# Altium schematic sheet beovox-poe.SchDoc (part 2 of 2)
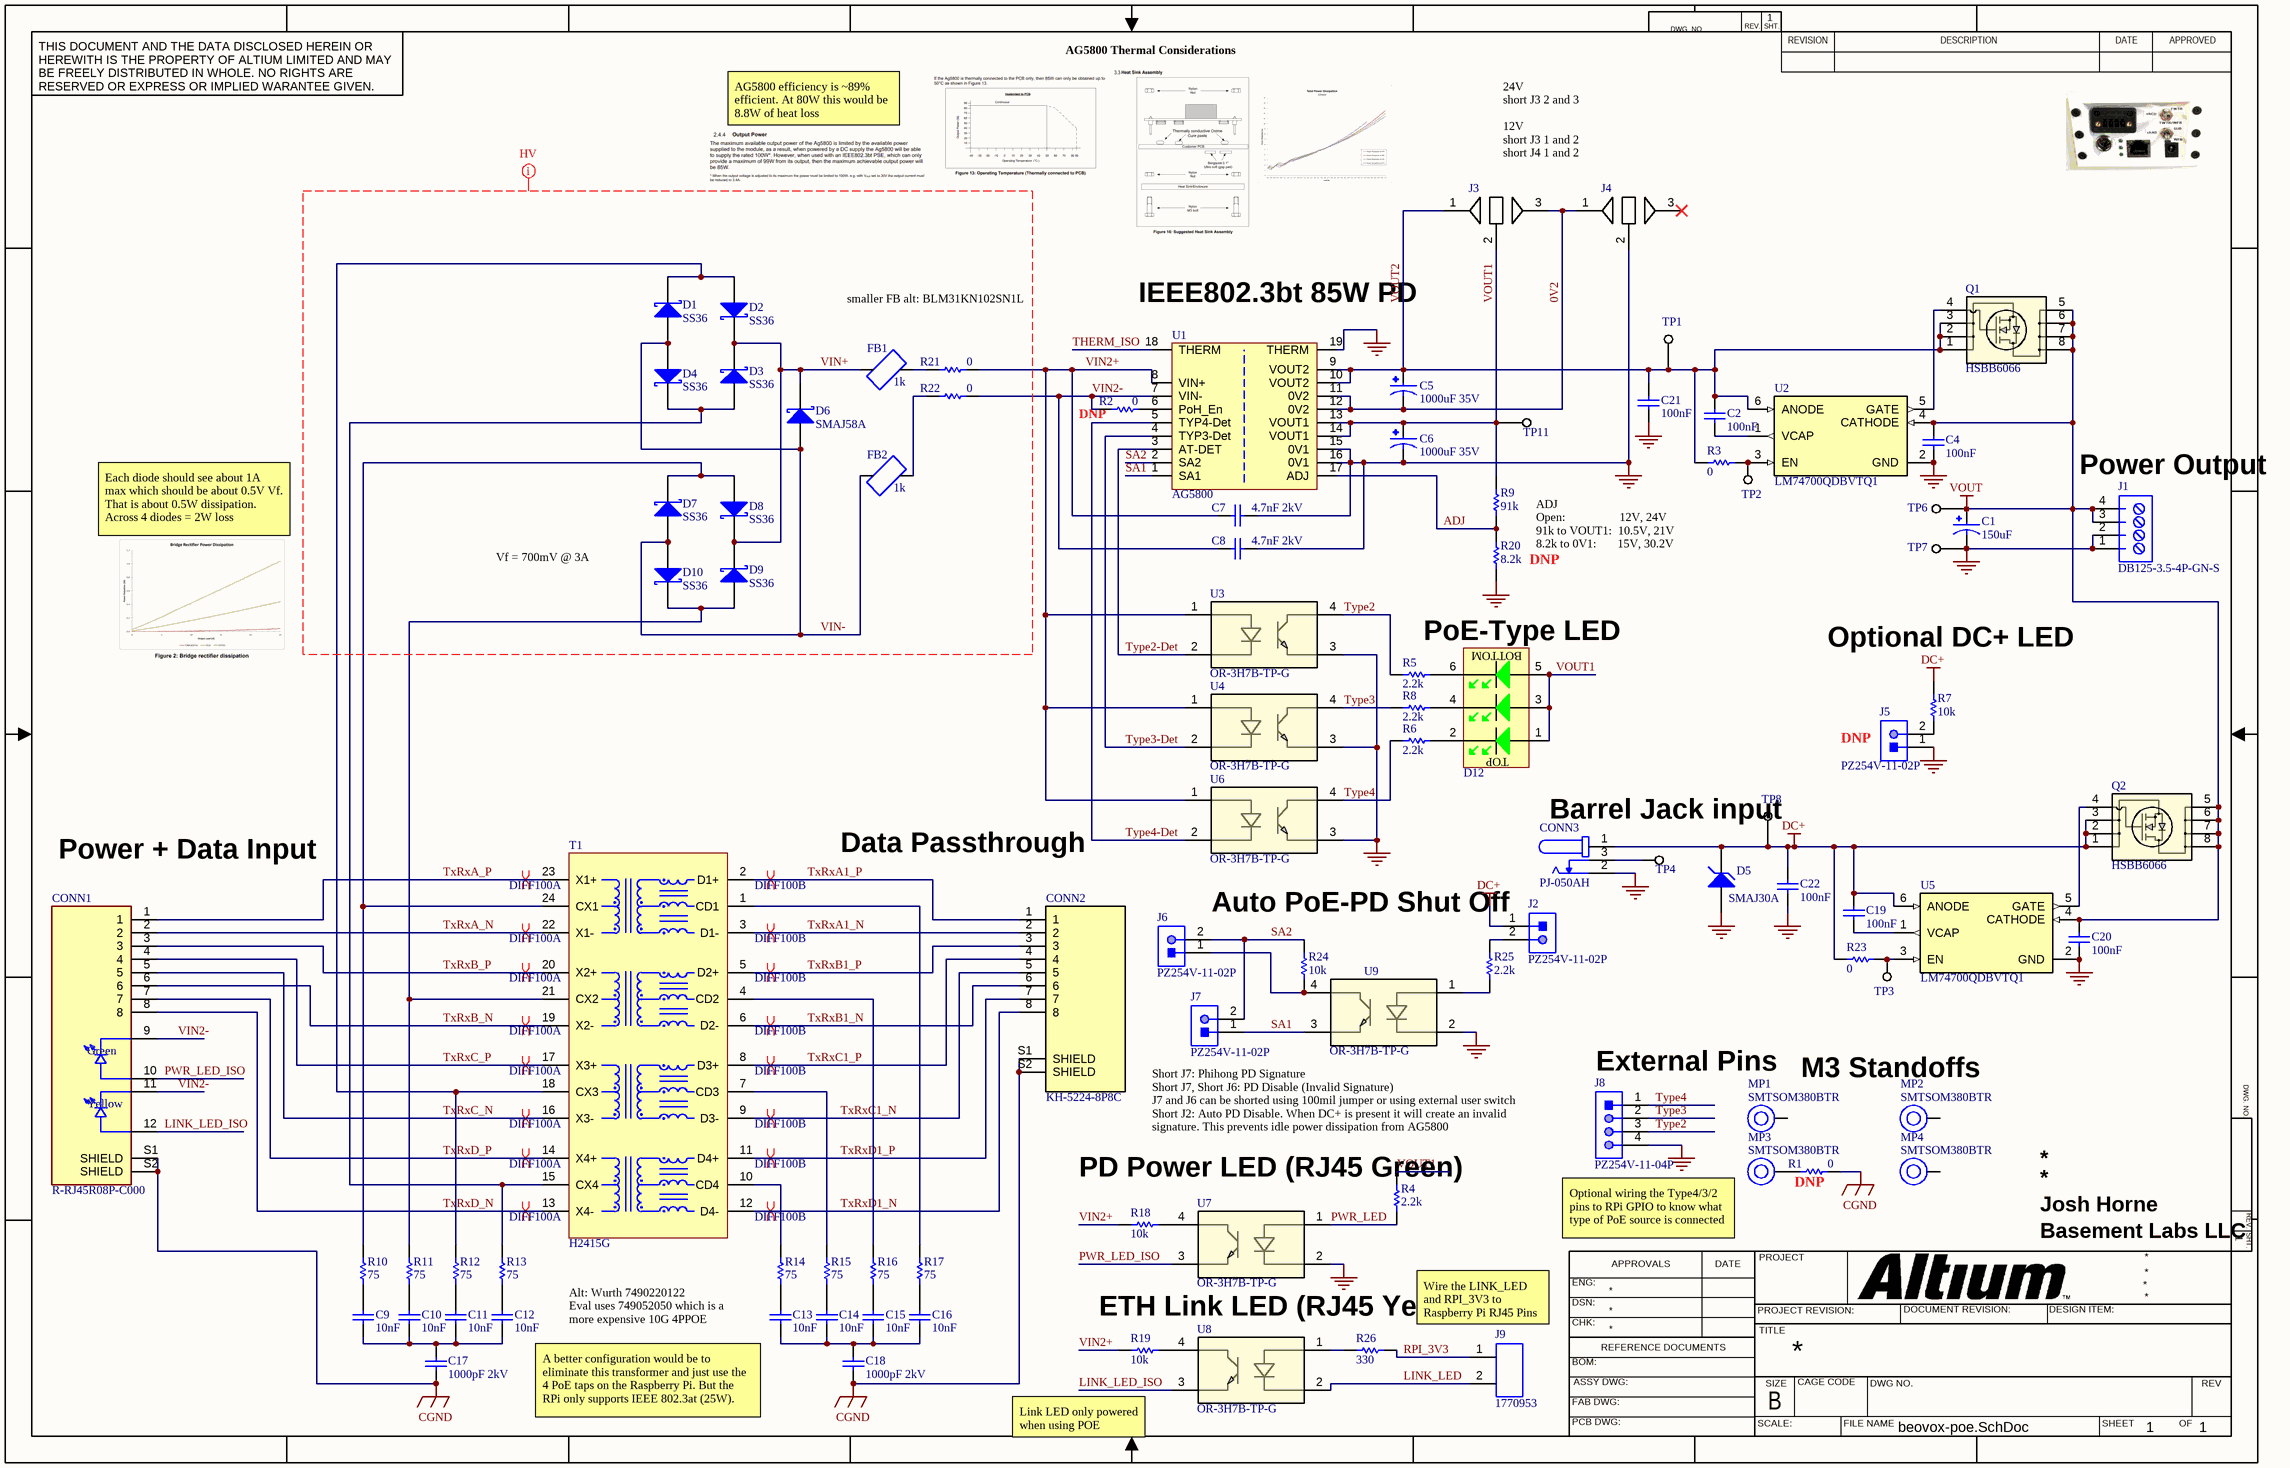
[diagram p1: beovox-poe.SchDoc]

## Library data of the parts
C1 = RC080M151LO10*16TH-2A1Et: 150uF 80V Aluminum Electrolytic Capacitors Through Hole,D10xL16mm 3000hrs@105℃; Manufacturer: BERYL Electronic Tech; ComponentLink1Description: LCSC; ComponentLink1URL: https://www.lcsc.com/product-detail/C7436420.html; Supplier: LCSC; Supplier Part Number: C7436420; Manufacturer Part Number: RC080M151LO10*16TH-2A1Et; Value: 150uF; Voltage: 80V
C2 C4 C19-C22 = C0603 100nF 50V X7R 10%: Multilayer Ceramic Capacitor, CC Series, 0.1 - F, - 10%, X7R, 50 V, 0603 [1608 Metric]; Manufacturer: Yageo; Manufacturer Part Number: CC0603KRX7R9BB104; Voltage Rating: 50V; Supplier 1: Future Electronics; RoHS: Yes; Category: Ceramic Capacitors; Stock 1: 10824000; Pricing 1: 4000=0.0056, 16000=0.0051, 20000=0.0053, 60000=0.0049, 80000=0.005, 160000=0.0048, 200000=0.0048, 400000=0.0046, 500000=0.0045 (USD); Mount: Surface Mount; Case/Package: 0603; Number of Pins: 2; Case Code (Metric): 1608; Case Code (Imperial): 0603; Dielectric Material: Ceramic; Material: Ceramic; Min Operating Temperature: -55°C; Max Operating Temperature: 125°C; Package Quantity: 1; Capacitance: 100nF; Tolerance: 10%; Packaging: Tape and Reel; Dielectric: X7R; Termination: SMD/SMT; Voltage: 50V; Series: CC; Length: 0.063inch; Width: 0.031inch; Height: 0.8mm; Thickness: 0.035inch; Depth: 0.8mm; Radiation Hardening: No; Reach SVHC Compliant: No; Lead Free: Lead Free; Halogen Free: Halogen Free; RoHS Compliant: Yes; ComponentLink1URL: https://datasheet.ciiva.com/11786/0900766b80d84f1d-11786061.pdf?src-supplier=Rs; ComponentLink1Description: https://datasheet.ciiva.com/11786/0900766b80d84f1d-11786061.pdf?src-supplier=Rs; ComponentLink2URL: https://datasheet.ciiva.com/31394/1489800-31394927.pdf?src-supplier=Farnell; ComponentLink2Description: https://datasheet.ciiva.com/31394/1489800-31394927.pdf?src-supplier=Farnell; ComponentLink3URL: https://datasheet.ciiva.com/144/mlccorderingcode-144176.pdf?src-supplier=Digikey; ComponentLink3Description: https://datasheet.ciiva.com/144/mlccorderingcode-144176.pdf?src-supplier=Digikey; ComponentLink4URL: https://datasheet.ciiva.com/144/mlccorderingcode-144177.pdf?src-supplier=Digikey; ComponentLink4Description: https://datasheet.ciiva.com/144/mlccorderingcode-144177.pdf?src-supplier=Digikey; ComponentLink5URL: https://datasheet.ciiva.com/144/mlccorderingcode-144178.pdf?src-supplier=Digikey; ComponentLink5Description: https://datasheet.ciiva.com/144/mlccorderingcode-144178.pdf?src-supplier=Digikey; ComponentLink6URL: https://datasheet.ciiva.com/7978/1489800-7978166.pdf?src-supplier=Element14; ComponentLink6Description: https://datasheet.ciiva.com/7978/1489800-7978166.pdf?src-supplier=Element14; ComponentLink7URL: https://datasheet.ciiva.com/8033/70765-8033819.pdf?src-supplier=Element14; ComponentLink7Description: https://datasheet.ciiva.com/8033/70765-8033819.pdf?src-supplier=Element14; ComponentLink8URL: https://datasheet.ciiva.com/8033/70765-8033821.pdf?src-supplier=Element14; ComponentLink8Description: https://datasheet.ciiva.com/8033/70765-8033821.pdf?src-supplier=Element14; ComponentLink9URL: https://datasheet.ciiva.com/22749/1489800-22749214.pdf?src-supplier=Element14; ComponentLink9Description: https://datasheet.ciiva.com/22749/1489800-22749214.pdf?src-supplier=Element14; Supplier Part Number 1: 3035896; ComponentLink10Description: LCSC; ComponentLink10URL: https://www.lcsc.com/product-detail/Multilayer-Ceramic-Capacitors-MLCC-SMD-SMT_YAGEO-CC0603KRX7R9BB104_C14663.html; Supplier: LCSC; Supplier Part Number: C14663
C5 C6 = ERR1VM102G20OT: 1000uF 35V ±20% Plugin,D10xL20mm Aluminum Electrolytic Capacitors - Leaded ROHS; Manufacturer: AISHI; Supplier: LCSC; Supplier Part Number: C398835; ComponentLink1Description: LCSC; ComponentLink1URL: https://www.lcsc.com/product-detail/Aluminum-Electrolytic-Capacitors-Leaded_AISHI-Aihua-Group-ERR1VM102G20OT_C398835.html; Manufacturer Part Number: ERR1VM102G20OT; Value: 1000uF; Voltage: 35V
C7 C8 = 1206B472K202NT: 2kV 4700pF X7R ±10% 1206 Multilayer Ceramic Capacitors MLCC - SMD/SMT ROHS; Manufacturer: FH (Guangdong Fenghua Advanced Tech); Supplier: LCSC; Supplier Part Number: C41017; Manufacturer Part Number: 1206B472K202NT; ComponentLink1Description: LCSC; ComponentLink1URL: https://www.lcsc.com/product-detail/Multilayer-Ceramic-Capacitors-MLCC-SMD-SMT_FH-Guangdong-Fenghua-Advanced-Tech-1206B472K202NT_C41017.html
C9-C16 = 0603B103K101CT: Multilayer Ceramic Capacitor, 0.01 F, 10%, X7R, 100 V, 0603 [1608 Metric] Rohs Compliant: Yes; Manufacturer: Walsin Technologies; Voltage Rating: 100V; Supplier 1: Arrow Electronics; Manufacturer Part Number: 0603B103K101CT; RoHS: Yes; Category: Ceramic Capacitors; Stock 1: 100000; Pricing 1: 4000=0.00810, 8000=0.00720, 12000=0.00620, 40000=0.00610 (USD); Case/Package: 0603; Case Code (Metric): 1608; Case Code (Imperial): 0603; Min Operating Temperature: -55°C; Max Operating Temperature: 125°C; Capacitance: 10nF; Tolerance: 10%; Packaging: Tape and Reel; Dielectric: X7R; Voltage Rating (DC): 100V; Length: 1.6mm; Depth: 0.8mm; RoHS Compliant: Yes; ComponentLink1URL: http://www.farnell.com/datasheets/2340522.pdf?src-supplier=Farnell; ComponentLink1Description: http://www.farnell.com/datasheets/2340522.pdf?src-supplier=Farnell; ComponentLink2URL: http://www.passivecomponent.com/wp-content/uploads/2018/10/MLCC.pdf?src-supplier=Digi-Key; ComponentLink2Description: http://www.passivecomponent.com/wp-content/uploads/2018/10/MLCC.pdf?src-supplier=Digi-Key; ComponentLink3URL: http://www.passivecomponent.com/indexsea/0603B103K101CT-IS.pdf?src-supplier=Digi-Key; ComponentLink3Description: http://www.passivecomponent.com/indexsea/0603B103K101CT-IS.pdf?src-supplier=Digi-Key; Supplier Part Number 1: 0603B103K101CT; ComponentLink4Description: http://www.farnell.com/datasheets/2340522.pdf?src-supplier=Element14; ComponentLink4URL: http://www.farnell.com/datasheets/2340522.pdf?src-supplier=Element14; Supplier: LCSC; Supplier Part Number: C302008; REACH SVHC: Unknown; ComponentLink5URL: http://www.farnell.com/datasheets/2340522.pdf?src-supplier=Newark; ComponentLink5Description: http://www.farnell.com/datasheets/2340522.pdf?src-supplier=Newark; ComponentLink6Description: LCSC; ComponentLink6URL: https://www.lcsc.com/product-detail/Multilayer-Ceramic-Capacitors-MLCC-SMD-SMT_Walsin-Tech-Corp-0603B103K101CT_C302008.html
C17 C18 = CC1206KKX7RDBB102: Multilayer Ceramic Capacitor, 1000 pF, 2000 V, ± 10%, X7R, 1206 [3216 Metric]; Manufacturer: Yageo; Material: 4241ConductorMaterial; Capacitance: 1nF; Dissipation Factor: 2.5%; Insulation Resistance: 10GR; Supplier 1: Future Electronics; Manufacturer Part Number: CC1206KKX7RDBB102; RoHS: Yes; Category: Ceramic Capacitors; Stock 1: 1107000; Pricing 1: 3000=0.0177, 9000=0.0171, 30000=0.0164, 60000=0.016, 120000=0.0154 (USD); Mount: Surface Mount; Case/Package: 1206; Number of Pins: 2; Case Code (Metric): 3216; Case Code (Imperial): 1206; Min Operating Temperature: -55°C; Max Operating Temperature: 125°C; Tolerance: 10%; Dielectric: X7R; Packaging: Tape and Reel; Termination: SMD/SMT; Voltage: 2kV; Package Quantity: 1; Voltage Rating: 2kV; Voltage Rating (DC): 2kV; Series: CC; Construction: Flat; Length: 3.2mm; Width: 0.063inch; Height: 1.25mm; Depth: 1.6mm; Thickness: 0.057inch; Radiation Hardening: No; RoHS Compliant: Yes; Lead Free: Lead Free; Reach SVHC Compliant: Unknown; ComponentLink1URL: https://datasheet.ciiva.com/23942/1449957-23942422.pdf?src-supplier=Newark; ComponentLink1Description: https://datasheet.ciiva.com/23942/1449957-23942422.pdf?src-supplier=Newark; ComponentLink2URL: https://datasheet.ciiva.com/186/upy-np0x7r-hv-1kv-to-3kv-4-186736.pdf?src-supplier=Digi-Key; ComponentLink2Description: https://datasheet.ciiva.com/186/upy-np0x7r-hv-1kv-to-3kv-4-186736.pdf?src-supplier=Digi-Key; ComponentLink3URL: https://datasheet.ciiva.com/186/upy-np0x7r-hv-1kv-to-3kv-4-186735.pdf?src-supplier=Digi-Key; ComponentLink3Description: https://datasheet.ciiva.com/186/upy-np0x7r-hv-1kv-to-3kv-4-186735.pdf?src-supplier=Digi-Key; ComponentLink4URL: https://datasheet.ciiva.com/186/upy-np0x7r-hv-1kv-to-3kv-4-186737.pdf?src-supplier=Digi-Key; ComponentLink4Description: https://datasheet.ciiva.com/186/upy-np0x7r-hv-1kv-to-3kv-4-186737.pdf?src-supplier=Digi-Key; ComponentLink5URL: https://datasheet.ciiva.com/13386/upy-gp-np0-16v-to-50v-8-13386312.pdf?src-supplier=Mouser; ComponentLink5Description: https://datasheet.ciiva.com/13386/upy-gp-np0-16v-to-50v-8-13386312.pdf?src-supplier=Mouser; Supplier Part Number 1: 2008092; Supplier: LCSC; Supplier Part Number: C23631; Value: 1000pF 2kV; ComponentLink6Description: LCSC; ComponentLink6URL: https://www.lcsc.com/product-detail/Multilayer-Ceramic-Capacitors-MLCC-SMD-SMT_YAGEO-CC1206KKX7RDBB102_C23631.html
CONN1 = R-RJ45R08P-C000: RJ45 RJReceptacle 1 有屏蔽 Right-Angle WithLED 0℃~+70℃ Plugin Ethernet Connectors/Modular Connectors (RJ45 RJ11) ROHS; Manufacturer: Ckmtw; Supplier: LCSC; Supplier Part Number: C386757; Manufacturer Part Number: R-RJ45R08P-C000; ComponentLink1Description: LCSC; ComponentLink1URL: https://www.lcsc.com/product-detail/Ethernet-Connectors-Modular-Connectors-RJ45-RJ11_Ckmtw-Shenzhen-Cankemeng-R-RJ45R08P-C000_C386757.html
CONN2 = KH-5224-8P8C: Jack Modular Connector RJ45 Through Hole Shielded; Manufacturer: Kinghelm; Supplier: LCSC; Supplier Part Number: C2683357; Manufacturer Part Number: KH-5224-8P8C; ComponentLink1Description: LCSC; ComponentLink1URL: https://www.lcsc.com/product-detail/C2683357.html?spm=wm.fly.bg.28.xh&lcsc_vid=QlNcX1QCFlleAgYFTwAPUwdVRFJdA1ICT1MNBVIAEVgxVlNRQVFbUFdRT1VfXzsOAxUeFF5JWBYZEEoKFBINSQcJGk4%3D
CONN3 = PJ-050AH: 2.0 x 6.0 mm, 5.0 A, Horizontal, Through Hole, Pick-n-Place Top, Dc Power Jack Connector; Manufacturer: Same Sky; Current Rating: 5A; Inside Diameter: 2mm; Number of Conductors: 2; Outside Diameter: 6mm; Shielding: Unshielded; Voltage Rating: 24V; Supplier 1: DigiKey; Manufacturer Part Number: PJ-050AH; RoHS: Compliant; Category: Power Connectors; Stock 1: 43845; Pricing 1: 1=1.16, 10=0.988, 25=0.9256, 50=0.8814, 100=0.8393, 250=0.78672, 500=0.74916, 1000=0.71339, 2500=0.66873 (USD); Contact Plating: Silver; Export Control Classification Number (ECCN) Code: EAR99; Harmonized Tariff Schedule (HTS) Code: 8536.69.40.20; Introduction Date: 2018-06-13; Lifecycle Status: Production; Max Operating Temperature: 85°C; Min Operating Temperature: -25°C; Mount: Through Hole; Number of Pins: 2; Orientation: Horizontal; REACH SVHC: Yes; Schedule B: 8536695050, 8536695050|8536695050, 8536695050|8536695050|8536695050, 8536695050|8536695050|8536695050|8536695050; Voltage Rating (DC): 24V; ComponentLink1URL: https://datasheet.octopart.com:443/PJ-050AH-Same-Sky-datasheet-188849567.pdf?src-supplier=Same+Sky; ComponentLink1Description: https://datasheet.octopart.com:443/PJ-050AH-Same-Sky-datasheet-188849567.pdf?src-supplier=Same+Sky; ComponentLink2URL: https://datasheet.octopart.com:443/PJ-050AH-Same-Sky-datasheet-181917340.pdf?src-supplier=Same+Sky; ComponentLink2Description: https://datasheet.octopart.com:443/PJ-050AH-Same-Sky-datasheet-181917340.pdf?src-supplier=Same+Sky; ComponentLink3URL: https://datasheet.octopart.com:443/PJ-050AH-Same-Sky-datasheet-181917339.pdf?src-supplier=Same+Sky; ComponentLink3Description: https://datasheet.octopart.com:443/PJ-050AH-Same-Sky-datasheet-181917339.pdf?src-supplier=Same+Sky; ComponentLink4URL: https://datasheet.octopart.com:443/PJ-050AH-CUI-Devices-datasheet-175924817.pdf?src-supplier=Same+Sky; ComponentLink4Description: https://datasheet.octopart.com:443/PJ-050AH-CUI-Devices-datasheet-175924817.pdf?src-supplier=Same+Sky; ComponentLink5URL: https://datasheet.octopart.com:443/PJ-050AH-CUI-Devices-datasheet-137941395.pdf?src-supplier=Same+Sky; ComponentLink5Description: https://datasheet.octopart.com:443/PJ-050AH-CUI-Devices-datasheet-137941395.pdf?src-supplier=Same+Sky; ComponentLink6URL: https://datasheet.octopart.com:443/PJ-050AH-CUI-Devices-datasheet-180437501.pdf?src-supplier=IHS; ComponentLink6Description: https://datasheet.octopart.com:443/PJ-050AH-CUI-Devices-datasheet-180437501.pdf?src-supplier=IHS; ComponentLink7URL: https://datasheet.octopart.com:443/PJ-050AH-Same-Sky-datasheet-190141980.pdf?src-supplier=element14+APAC; ComponentLink7Description: https://datasheet.octopart.com:443/PJ-050AH-Same-Sky-datasheet-190141980.pdf?src-supplier=element14+APAC; ComponentLink8URL: https://datasheet.octopart.com:443/PJ-050AH-Same-Sky-datasheet-182880940.pdf?src-supplier=Electro+Sonic; ComponentLink8Description: https://datasheet.octopart.com:443/PJ-050AH-Same-Sky-datasheet-182880940.pdf?src-supplier=Electro+Sonic; ComponentLink9URL: https://datasheet.octopart.com:443/PJ-050AH-CUI-Devices-datasheet-175925602.pdf?src-supplier=Master+Electronics; ComponentLink9Description: https://datasheet.octopart.com:443/PJ-050AH-CUI-Devices-datasheet-175925602.pdf?src-supplier=Master+Electronics; ComponentLink10URL: https://datasheet.octopart.com:443/PJ-050AH-CUI-Devices-datasheet-141000282.pdf?src-supplier=Master+Electronics; ComponentLink10Description: https://datasheet.octopart.com:443/PJ-050AH-CUI-Devices-datasheet-141000282.pdf?src-supplier=Master+Electronics; ComponentLink11URL: https://datasheet.octopart.com:443/PJ-050AH-CUI-Devices-datasheet-103111417.pdf?src-supplier=Master+Electronics; ComponentLink11Description: https://datasheet.octopart.com:443/PJ-050AH-CUI-Devices-datasheet-103111417.pdf?src-supplier=Master+Electronics; ComponentLink12URL: https://datasheet.octopart.com:443/PJ-050AH-Same-Sky-datasheet-189105235.pdf?src-supplier=Master+Electronics; ComponentLink12Description: https://datasheet.octopart.com:443/PJ-050AH-Same-Sky-datasheet-189105235.pdf?src-supplier=Master+Electronics; ComponentLink13URL: https://datasheet.octopart.com:443/PJ-050AH-Same-Sky-datasheet-182049891.pdf?src-supplier=Future+Electronics; ComponentLink13Description: https://datasheet.octopart.com:443/PJ-050AH-Same-Sky-datasheet-182049891.pdf?src-supplier=Future+Electronics; ComponentLink14URL: https://datasheet.octopart.com:443/PJ-050AH-CUI-Devices-datasheet-175923567.pdf?src-supplier=Future+Electronics; ComponentLink14Description: https://datasheet.octopart.com:443/PJ-050AH-CUI-Devices-datasheet-175923567.pdf?src-supplier=Future+Electronics; ComponentLink15URL: https://datasheet.octopart.com:443/PJ-050AH-CUI-Devices-datasheet-137760689.pdf?src-supplier=Future+Electronics; ComponentLink15Description: https://datasheet.octopart.com:443/PJ-050AH-CUI-Devices-datasheet-137760689.pdf?src-supplier=Future+Electronics; ComponentLink16URL: https://datasheet.octopart.com:443/PJ-050AH-CUI-Devices-datasheet-175927643.pdf?src-supplier=CUI+Devices+SCT; ComponentLink16Description: https://datasheet.octopart.com:443/PJ-050AH-CUI-Devices-datasheet-175927643.pdf?src-supplier=CUI+Devices+SCT; ComponentLink17URL: https://datasheet.octopart.com:443/PJ-050AH-CUI-Devices-datasheet-142370881.pdf?src-supplier=CUI+Devices+SCT; ComponentLink17Description: https://datasheet.octopart.com:443/PJ-050AH-CUI-Devices-datasheet-142370881.pdf?src-supplier=CUI+Devices+SCT; ComponentLink18URL: https://octopart.com:443/opatz8j6/c1?t=i1HNAP8sau4DI-LZx3jDgI0-SWlYt3fLx_IRO_2-_sGd8kJlzHOsJDbcJeITI66mPXy8W__Xgt3piNIobSJpvViutKRXA4bS4Nrz0A8VAN4c8JG51UBHIn2tin4HAiUxuxhA7LdmnYlJsfGQu4wYFxkunNJbmBP4RDTvO_9ujz0txzSwc7TQjMJP2liQb9TTCHcH4_0bcC0I0RPZ1OY3ZJDDsG_xX9EgIXLeakTO5TNd2iYSdlOWFMgXhUfzV2AZOxi4wCzVrZ3pS8qpnh6vhskC-yXDoQGycuq9NoVRigowJ_F47T6Jf_exHFrpKD5_tLQCHcwME9nRgdOqiRs_2Sf2sHpBOw&src-supplier=Compliance+Statements; ComponentLink18Description: https://octopart.com:443/opatz8j6/c1?t=i1HNAP8sau4DI-LZx3jDgI0-SWlYt3fLx_IRO_2-_sGd8kJlzHOsJDbcJeITI66mPXy8W__Xgt3piNIobSJpvViutKRXA4bS4Nrz0A8VAN4c8JG51UBHIn2tin4HAiUxuxhA7LdmnYlJsfGQu4wYFxkunNJbmBP4RDTvO_9ujz0txzSwc7TQjMJP2liQb9TTCHcH4_0bcC0I0RPZ1OY3ZJDDsG_xX9EgIXLeakTO5TNd2iYSdlOWFMgXhUfzV2AZOxi4wCzVrZ3pS8qpnh6vhskC-yXDoQGycuq9NoVRigowJ_F47T6Jf_exHFrpKD5_tLQCHcwME9nRgdOqiRs_2Sf2sHpBOw&src-supplier=Compliance+Statements; ComponentLink19URL: https://octopart.com:443/opatz8j6/c1?t=wghVw_L1We_XWVlVY8JyDPw6lxvMinRws7-ARU-VAWs-ryFcBuT4vQKX4NLeCdwIA5aNEyug047cBfxCvivV2siU9ei9l80cJNjSbW06i8UrCY_EzWCp-dyawC3hrJNXrvZBXw-IQXK5amSqRYS1pt4_DqC-jT23v6yNOp-UfvUw-7gTEcBL8SujWfUUfSgsI8u124iBLyBSRX1OLjM7MRIPYR4R97L9CtcepMoCH6l_FDhW7at-B344Ry8AMoz31TQfvrWYgCManlUz1zqOBKOHlrNi2ifiEYHdtYXUYuwDLdPu8m0ipxZrudx8zgq-sTX51For5OOvefaN7lFtuiKG6VH6xbMjNYw&src-supplier=Compliance+Statements; ComponentLink19Description: https://octopart.com:443/opatz8j6/c1?t=wghVw_L1We_XWVlVY8JyDPw6lxvMinRws7-ARU-VAWs-ryFcBuT4vQKX4NLeCdwIA5aNEyug047cBfxCvivV2siU9ei9l80cJNjSbW06i8UrCY_EzWCp-dyawC3hrJNXrvZBXw-IQXK5amSqRYS1pt4_DqC-jT23v6yNOp-UfvUw-7gTEcBL8SujWfUUfSgsI8u124iBLyBSRX1OLjM7MRIPYR4R97L9CtcepMoCH6l_FDhW7at-B344Ry8AMoz31TQfvrWYgCManlUz1zqOBKOHlrNi2ifiEYHdtYXUYuwDLdPu8m0ipxZrudx8zgq-sTX51For5OOvefaN7lFtuiKG6VH6xbMjNYw&src-supplier=Compliance+Statements; ComponentLink20URL: https://octopart.com:443/opatz8j6/c1?t=2_WbWo_pjT-AGMZJ9OQyYCnH7mubsPdZALBDoVNei6KrV_IJjYFhq8H0kH6bJt5HXLU_kSM462KjxS6S93sfBWBhXllcdMUOW5uUkFoO8Z-X-V9fHvlvoFqHTLFpSA2_nIMsODPkX3eq3Z_QcS6RZ0G0moIALLZaz5osZaUUtGDom_OSRSJJ983Ee6OC2wkAKsSF_mfcXI5Hw5uKrkMhLylyvUVHrLyCkIp7sDv8gEkhEgjpLCTJ6fzmZzlstrZUr7VR9KoJzewnrvBxvFLR-UjI8AZw4Tnb4SG4kqVxv10bMQ-fg732zY5MnvzV3ohKdJvlg_bIkjJxFpuQir69v0P-Xf72NA&src-supplier=Compliance+Statements; ComponentLink20Description: https://octopart.com:443/opatz8j6/c1?t=2_WbWo_pjT-AGMZJ9OQyYCnH7mubsPdZALBDoVNei6KrV_IJjYFhq8H0kH6bJt5HXLU_kSM462KjxS6S93sfBWBhXllcdMUOW5uUkFoO8Z-X-V9fHvlvoFqHTLFpSA2_nIMsODPkX3eq3Z_QcS6RZ0G0moIALLZaz5osZaUUtGDom_OSRSJJ983Ee6OC2wkAKsSF_mfcXI5Hw5uKrkMhLylyvUVHrLyCkIp7sDv8gEkhEgjpLCTJ6fzmZzlstrZUr7VR9KoJzewnrvBxvFLR-UjI8AZw4Tnb4SG4kqVxv10bMQ-fg732zY5MnvzV3ohKdJvlg_bIkjJxFpuQir69v0P-Xf72NA&src-supplier=Compliance+Statements; ComponentLink21URL: https://octopart.com:443/opatz8j6/c1?t=8DYyr6UACYp_9EHoBQOMUJpe-oai5MtZyHfGsF7pMfqiyjsSsAlZxyG1X-4M3zPZXZjKmQkWcUbU005QJnBJ0VVRjtjOP6E0jnpPkUsKcjC4aqrxFP9fuOKb9IumRhvlA-YeXV-s67AJ9Ft3kafBMu_ZrryxXHEyusfRGv_sESHb_v2cGG7yXqcLMHQYIXRg53oH9-p2USlc4h_2uVf8lrwAuzWLZ-jnEAs8ZLSn6kwl23auHyfukigGyZzktJhlMS-c6-ffI1F_xetVy8m-uNDLnjE63CcaC0sp0xpLMmAGVVIs7dvYX1LTvWTLU-CH_THFZcN-5NbFwrXCu7zChi3WwqkNelJ-7s0&src-supplier=Compliance+Statements; ComponentLink21Description: https://octopart.com:443/opatz8j6/c1?t=8DYyr6UACYp_9EHoBQOMUJpe-oai5MtZyHfGsF7pMfqiyjsSsAlZxyG1X-4M3zPZXZjKmQkWcUbU005QJnBJ0VVRjtjOP6E0jnpPkUsKcjC4aqrxFP9fuOKb9IumRhvlA-YeXV-s67AJ9Ft3kafBMu_ZrryxXHEyusfRGv_sESHb_v2cGG7yXqcLMHQYIXRg53oH9-p2USlc4h_2uVf8lrwAuzWLZ-jnEAs8ZLSn6kwl23auHyfukigGyZzktJhlMS-c6-ffI1F_xetVy8m-uNDLnjE63CcaC0sp0xpLMmAGVVIs7dvYX1LTvWTLU-CH_THFZcN-5NbFwrXCu7zChi3WwqkNelJ-7s0&src-supplier=Compliance+Statements; Supplier Part Number 1: CP-050AH-ND; ComponentLink22Description: DigiKey; ComponentLink22URL: https://www.digikey.com/en/products/detail/same-sky-formerly-cui-devices/PJ-050AH/1644583; ComponentLink23Description: LCSC; ComponentLink23URL: https://www.lcsc.com/product-detail/C3096089.html?s_z=n_PJ-050AH; Supplier: LCSC; Supplier Part Number: C3096089
D1-D4 D7-D10 = SS36: 60V 700mV@3A 3A SMA(DO-214AC) Schottky Barrier Diodes (SBD) ROHS; Manufacturer: MDD; Value: 60V 3A; Supplier: LCSC; Supplier Part Number: C16015; Manufacturer Part Number: SS36; ComponentLink1Description: LCSC; ComponentLink1URL: https://www.lcsc.com/product-detail/Schottky-Barrier-Diodes-SBD_MDD-Microdiode-Electronics-SS36_C16015.html
D5 = SMAJ30A: Diode TVS Single Uni-Dir 30V 400W 2-Pin SMA; Manufacturer: Littelfuse; Direction: Unidirectional; Max Surge Current: 8.3A; Number of Elements: 1; Reverse Breakdown Voltage: 33.3V; Clamping Voltage: 48.4V; Power Line Protection: No; Max Breakdown Voltage: 36.8V; Max Reverse Leakage Current: 1uA; Test Current: 1mA; Max Power Dissipation: 3.3W; Supplier 1: RSComponents; Manufacturer Part Number: SMAJ30A; RoHS: Yes; Category: TVS Diodes; Stock 1: 200; Pricing 1: 25=0.34200, 50=0.28200, 100=0.27200, 200=0.26800, 400=0.26200 (USD); Mount: Surface Mount; Case/Package: SMA; Number of Pins: 2; Min Operating Temperature: -65°C; Max Operating Temperature: 150°C; Package Quantity: 5000; Packaging: Tape and Reel; Operating Supply Voltage: 30V; Number of Unidirectional Channels: 1; Reverse Standoff Voltage: 30V; Min Breakdown Voltage: 33.3V; Peak Pulse Power: 400W; Breakdown Voltage: 33.3V; Number of Channels: 1; Polarity: Unidirectional; Termination: SMD/SMT; Power Dissipation: 400W; Peak Pulse Current: 8.3A; Element Configuration: Single; Leakage Current: 1uA; Voltage Rating (DC): 30V; Resistor Type: Zener; Length: 4.5mm; Width: 2.79mm; Height: 2.087mm; Radiation Hardening: No; REACH SVHC: No SVHC; Lead Free: Lead Free; RoHS Compliant: Yes; ComponentLink1URL: https://datasheet.ciiva.com/25624/0900766b810f4edb-25624874.pdf?src-supplier=RSComponents; ComponentLink1Description: https://datasheet.ciiva.com/25624/0900766b810f4edb-25624874.pdf?src-supplier=RSComponents; ComponentLink2URL: https://datasheet.ciiva.com/22638/607617-22638012.pdf?src-supplier=Element14; ComponentLink2Description: https://datasheet.ciiva.com/22638/607617-22638012.pdf?src-supplier=Element14; ComponentLink3URL: https://datasheet.ciiva.com/14162/smaj-eng-ds-14162071.pdf?src-supplier=Distrelec; ComponentLink3Description: https://datasheet.ciiva.com/14162/smaj-eng-ds-14162071.pdf?src-supplier=Distrelec; ComponentLink4URL: https://datasheet.ciiva.com/5771/littelfuse-tvs-diode-smaj-5771023.pdf?src-supplier=Farnell; ComponentLink4Description: https://datasheet.ciiva.com/5771/littelfuse-tvs-diode-smaj-5771023.pdf?src-supplier=Farnell; ComponentLink5URL: https://datasheet.ciiva.com/8062/littelfuse-tvs-diode-smaj-8062298.pdf?src-supplier=Element14; ComponentLink5Description: https://datasheet.ciiva.com/8062/littelfuse-tvs-diode-smaj-8062298.pdf?src-supplier=Element14; ComponentLink6URL: https://datasheet.ciiva.com/330/littelfuse-tvs-diode-smaj-datasheet-pdf-330695.pdf?src-supplier=Digi-Key; ComponentLink6Description: https://datasheet.ciiva.com/330/littelfuse-tvs-diode-smaj-datasheet-pdf-330695.pdf?src-supplier=Digi-Key; ComponentLink7URL: https://datasheet.ciiva.com/330/littelfuse-tvs-diode-smaj-datasheet-pdf-330696.pdf?src-supplier=Digi-Key; ComponentLink7Description: https://datasheet.ciiva.com/330/littelfuse-tvs-diode-smaj-datasheet-pdf-330696.pdf?src-supplier=Digi-Key; ComponentLink8URL: https://datasheet.ciiva.com/330/littelfuse-tvs-diode-smaj-datasheet-pdf-330694.pdf?src-supplier=Digi-Key; ComponentLink8Description: https://datasheet.ciiva.com/330/littelfuse-tvs-diode-smaj-datasheet-pdf-330694.pdf?src-supplier=Digi-Key; ComponentLink9Description: LCSC; ComponentLink9URL: https://www.lcsc.com/product-detail/C148230.html?s_z=n_SMAJ30A; Supplier: LCSC; Supplier Part Number: C148230
D6 = SMAJ58A: 4.3A 400W 93.6V 64.4V 58V SMA(DO-214AC) TVS ROHS; Manufacturer: GOODWORK; Value: 58V 400W; Manufacturer Part Number: SMAJ58A; Supplier: LCSC; Supplier Part Number: C2980408; ComponentLink1Description: LCSC; ComponentLink1URL: https://www.lcsc.com/product-detail/TVS_GOODWORK-SMAJ58A_C2980408.html
D12 = MHK33147CGBTD: 20mA 30mcd 雾状绿透镜 -40℃~+85℃ 568nm Green 60° 2.6V DIP-6-2.54mm Light Emitting Diodes (LED) ROHS; Manufacturer: MEIHUA; ComponentLink1Description: LCSC; ComponentLink1URL: https://www.lcsc.com/product-detail/Light-Emitting-Diodes-LED_MEIHUA-MHK33147CGBTD_C7470849.html; Manufacturer Part Number: MHK33147CGBTD; Supplier: LCSC; Supplier Part Number: C7470849
FB1 FB2 = FBMH4525HM102NTV: Ind Chip Bead Multi-Layer 1KOhm 30% 100MHz Ferrite 3A 1810 T/R; Manufacturer: TAIYO YUDEN; DC Resistance (DCR): 60mΩ; Impedance: 1kΩ; Number of Circuits: 1; Supplier 1: DigiKey; Manufacturer Part Number: FBMH4525HM102NTV; RoHS: Compliant; Category: Ferrite Beads and Chips; Stock 1: 1225; Pricing 1: 1=1.3, 10=0.909, 25=0.7796, 50=0.6908, 100=0.6084, 250=0.5202 (USD); Case/Package: 1810; Case Code (Imperial): 1810; Case Code (Metric): 4525; Current Rating: 3A; Export Control Classification Number (ECCN) Code: EAR99; Height: 2.5mm; Harmonized Tariff Schedule (HTS) Code: 8504.50.80.00; Introduction Date: 2013-09-23; Length: 4.5mm; Lifecycle Status: Production; Max Current Rating: 3A; Max DC Current: 3A; Max Length: 4.9mm; Max Operating Temperature: 125°C; Max Thickness: 2.8mm; Max Width: 2.8mm; Min Length: 4.1mm; Min Operating Temperature: -40°C; Min Thickness: 2.2mm; Min Width: 2.2mm; Mount: Surface Mount; Number of Lines: 1; Number of Terminals: 2; Packaging: Cut Tape (CT); Ratings: AEC-Q200; REACH SVHC: Yes; Resistance: 1kΩ; Schedule B: 8504500000; Termination: SMD/SMT; Test Frequency: 100MHz; Tolerance: 30%; Width: 2.5mm; ComponentLink1URL: https://datasheet.octopart.com:443/FBMH4525HM102NTV-Taiyo-Yuden-datasheet-153594123.pdf?src-supplier=IHS; ComponentLink1Description: https://datasheet.octopart.com:443/FBMH4525HM102NTV-Taiyo-Yuden-datasheet-153594123.pdf?src-supplier=IHS; ComponentLink2URL: https://datasheet.octopart.com:443/FBMH4525HM102NTV-Taiyo-Yuden-datasheet-112254973.pdf?src-supplier=Master+Electronics; ComponentLink2Description: https://datasheet.octopart.com:443/FBMH4525HM102NTV-Taiyo-Yuden-datasheet-112254973.pdf?src-supplier=Master+Electronics; Supplier Part Number 1: 587-3839-1-ND; ComponentLink3Description: DigiKey; ComponentLink3URL: https://www.digikey.com/en/products/detail/taiyo-yuden/FBMH4525HM102NTV/4875437; ComponentLink4Description: JLCPCB; ComponentLink4URL: https://jlcpcb.com/partdetail/TaiyoYuden-FBMH4525HM102NTV/C515372; Supplier: LCSC; Supplier Part Number: C515372
J1 = DB125-3.5-4P-GN-S: 1x4P -40℃~+105℃ 13.5A 250V Green 16~28 Straight pin 3.5mm 1 1 4 Plugin,P=3.5mm Screw terminal ROHS; Manufacturer: DIBO; Supplier: LCSC; Supplier Part Number: C2757925; Manufacturer Part Number: DB125-3.5-4P-GN-S; ComponentLink1Description: LCSC; ComponentLink1URL: https://www.lcsc.com/product-detail/Screw-terminal_DIBO-DB125-3-5-4P-GN-S_C2757925.html
J2 J5-J7 = PZ254V-11-02P: Straight Square Pins 2.5mm 6mm -40℃~+105℃ 1 3mm 2 2.54mm Black Brass 1x2P Plugin,P=2.54mm Pin Headers ROHS; Manufacturer: XFCN; Manufacturer Part Number: PZ254V-11-02P; Supplier Part Number: C492401; Supplier: LCSC
J3 J4 = Solder_Jumper_3
J8 = PZ254V-11-04P: 250V 3A Straight Square Pins 2.5mm 4P 6mm -40℃~+105℃ 3mm 2.54mm Plugin Black 1x4P Plugin,P=2.54mm Pin Headers ROHS; Manufacturer: XFCN; ComponentLink1Description: LCSC; ComponentLink1URL: https://www.lcsc.com/product-detail/Pin-Headers_XFCN-PZ254V-11-04P_C2691448.html; Supplier: LCSC; Supplier Part Number: C2691448; Manufacturer Part Number: PZ254V-11-04P
J9 = 1770953: TERM BLK 2P TOP ENTRY 2.5MM PCB; Manufacturer: Phoenix Contact; Current Rating: 6A; Voltage Rating: 200V; Number of Positions: 2; Number of Levels: 1; Current: 5A; Voltage: 150V; Wire Gauge (Max): 26AWG; Wire Gauge (Min): 24AWG; Supplier 1: Digi-Key; Supplier Part Number 1: 277-2086-1-ND; Manufacturer Part Number: 1770953; RoHS: Yes; Category: Terminal Blocks; Stock 1: 1488; Pricing 1: 1=0.60000, 10=0.58000, 50=0.55440, 100=0.53930 (USD); Mount: Through Hole; Color: Black; Housing Color: Black; Contact Plating: Tin; Housing Material: Polymer; Packaging: Tape and Reel; Package Quantity: 310; Orientation: Vertical; Termination: Screwless; Number of Positions Per Level: 2; Number of Poles: 2; Length: 5mm; Pitch: 2.5mm; Lead Free: Lead Free; Flammability Rating: UL94 V-0; ComponentLink1URL: https://datasheet.ciiva.com/824/1770953-824227.pdf?src-supplier=Digi-Key; ComponentLink1Description: https://datasheet.ciiva.com/824/1770953-824227.pdf?src-supplier=Digi-Key; ComponentLink2URL: https://datasheet.ciiva.com/29121/567312-da-01-de-printklemme-1770953-310-st-29121147.pdf?src-supplier=Conrad; ComponentLink2Description: https://datasheet.ciiva.com/29121/567312-da-01-de-printklemme-1770953-310-st-29121147.pdf?src-supplier=Conrad; ComponentLink3URL: https://datasheet.ciiva.com/824/1770953-824228.pdf?src-supplier=Digi-Key; ComponentLink3Description: https://datasheet.ciiva.com/824/1770953-824228.pdf?src-supplier=Digi-Key; ComponentLink4Description: LCSC; ComponentLink4URL: 1770953; Supplier: LCSC; Supplier Part Number: C3817232
MP1-MP4 = SMTSOM380BTR: M3 Round Nut 8mm height; Manufacturer: YIYUAN; Supplier: LCSC; Supplier Part Number: C5301772; ComponentLink1Description: LCSC; ComponentLink1URL: https://www.lcsc.com/product-detail/Other-nuts_YIYUAN-SMTSOM380BTR_C5301772.html; Manufacturer Part Number: SMTSOM380BTR
Q1 Q2 = HSBB6066: N-Channel 60V 60A 45W PRPAK3x3-8L; Manufacturer: HUASHUO; RDSon: 5.2mOhm; Manufacturer Part Number: HSBB6066; ComponentLink1URL: https://www.lcsc.com/product-detail/C2828498.html; ComponentLink1Description: LCSC; Supplier: LCSC; Supplier Part Number: HSBB6066; Vds: 60V; Drain Current Id: 60A
R1 = RC0805JR-070RL: Surface Mount Thick Film Resistor, RC Series, 125 mW, - 5%, 150 V, 0805 [2012 Metric]; Manufacturer: Yageo; Resistance: 0mR; Power Rating: 125mW; Voltage Rating: 150V; Temperature Coefficient: 200ppm/°C; Supplier 1: Arrow Electronics; Manufacturer Part Number: RC0805JR-070RL; RoHS: Yes; Category: Chip SMD Resistors; Stock 1: 5861000; Pricing 1: 5000=0.00430, 10000=0.00390, 25000=0.00350, 50000=0.00270 (USD); Case/Package: 0805; Number of Pins: 2; Contact Plating: Tin,Matte; Case Code (Imperial): 0805; Case Code (Metric): 2012; Size Code: 0805; Min Operating Temperature: -55°C; Max Operating Temperature: 155°C; Resistor Type: Thick Film; Tolerance: 5%; Packaging: Tape and Reel; Voltage Rating (DC): 150V; Termination: SMD/SMT; Features: Moisture Resistant; Series: RC; Max Power Dissipation: 125mW; Number of Terminations: 2; Construction: Rectangular; Technology: THICK FILM; Resistance Tolerance: 5%; Length: 2mm; Width: 1.25mm; Height: 0.5mm; Depth: 1.25mm; Radiation Hardening: No; RoHS Compliant: Yes; REACH SVHC: Unknown; Military Standard: Not; Lead Free: Lead Free; ComponentLink1URL: https://datasheet.ciiva.com/11819/0900766b8106beab-11819430.pdf?src-supplier=RSComponents; ComponentLink1Description: https://datasheet.ciiva.com/11819/0900766b8106beab-11819430.pdf?src-supplier=RSComponents; ComponentLink2URL: https://datasheet.ciiva.com/7941/1738694-7941861.pdf?src-supplier=Element14; ComponentLink2Description: https://datasheet.ciiva.com/7941/1738694-7941861.pdf?src-supplier=Element14; ComponentLink3URL: https://datasheet.ciiva.com/7941/1738694-7941862.pdf?src-supplier=Element14; ComponentLink3Description: https://datasheet.ciiva.com/7941/1738694-7941862.pdf?src-supplier=Element14; ComponentLink4URL: https://datasheet.ciiva.com/7941/1738694-7941863.pdf?src-supplier=Element14; ComponentLink4Description: https://datasheet.ciiva.com/7941/1738694-7941863.pdf?src-supplier=Element14; ComponentLink5URL: https://datasheet.ciiva.com/15190/getdatasheetpartid-330685-15190028.pdf?src-supplier=Verical; ComponentLink5Description: https://datasheet.ciiva.com/15190/getdatasheetpartid-330685-15190028.pdf?src-supplier=Verical; Supplier Part Number 1: RC0805JR-070RL
R2 R3 R23 = R0603 0R 1% 100mW: Thick Film Resistors - SMD RMC 0603 1/10W 1% T/R-5000; Manufacturer: Royal Ohm; Manufacturer Part Number: 0603WAF0000T5E; Resistance: 0Ω; Supplier 1: Mouser; Category: Uncategorized; Stock 1: 75000; Pricing 1: 10000=0.001 (USD); ComponentLink1URL: https://datasheet.octopart.com:443/0603WAF0000T5E-Royal-Ohm-datasheet-165785611.pdf?src-supplier=TME; ComponentLink1Description: https://datasheet.octopart.com:443/0603WAF0000T5E-Royal-Ohm-datasheet-165785611.pdf?src-supplier=TME; ComponentLink2URL: https://datasheet.octopart.com:443/0603WAF0000T5E-Royal-Ohm-datasheet-157855877.pdf?src-supplier=TME; ComponentLink2Description: https://datasheet.octopart.com:443/0603WAF0000T5E-Royal-Ohm-datasheet-157855877.pdf?src-supplier=TME; ComponentLink3URL: https://datasheet.octopart.com:443/0603WAF0000T5E-Royal-Ohm-datasheet-62069544.pdf?src-supplier=TME; ComponentLink3Description: https://datasheet.octopart.com:443/0603WAF0000T5E-Royal-Ohm-datasheet-62069544.pdf?src-supplier=TME; Supplier Part Number 1: 303-0603WAF0000T5E; ComponentLink4Description: JLCPCB; ComponentLink4URL: https://jlcpcb.com/partdetail/21903-0603WAF0000T5E/C21189; Supplier: LCSC; Supplier Part Number: C21189
R4-R6 R8 R25 = R0603 2K2 1% 100mW: Res Thick Film 0603 2.2K Ohm 1% 0.1W(1/10W) ±100ppm/C Pad SMD T/R; Manufacturer: Royal Ohm; Manufacturer Part Number: 0603WAF2201T5E; Resistance: 2.2kΩ; Supplier 1: Mouser; Supplier Part Number 1: 303-0603WAF2201T5E; Stock 1: 150000; Pricing 1: 10000=0.001 (USD); ComponentLink1URL: https://datasheet.octopart.com:443/0603WAF2201T5E-Royal-Ohm-datasheet-165785611.pdf?src-supplier=TME; ComponentLink1Description: https://datasheet.octopart.com:443/0603WAF2201T5E-Royal-Ohm-datasheet-165785611.pdf?src-supplier=TME; ComponentLink2URL: https://datasheet.octopart.com:443/0603WAF2201T5E-Royal-Ohm-datasheet-157855877.pdf?src-supplier=TME; ComponentLink2Description: https://datasheet.octopart.com:443/0603WAF2201T5E-Royal-Ohm-datasheet-157855877.pdf?src-supplier=TME; ComponentLink3URL: https://datasheet.octopart.com:443/0603WAF2201T5E-Royal-Ohm-datasheet-62069544.pdf?src-supplier=TME; ComponentLink3Description: https://datasheet.octopart.com:443/0603WAF2201T5E-Royal-Ohm-datasheet-62069544.pdf?src-supplier=TME; ComponentLink4URL: https://jlcpcb.com/partdetail/4597-0603WAF2201T5E/C4190; ComponentLink4Description: JLCPCB; Category: Uncategorized; Supplier: LCSC; Supplier Part Number: C4190
R7 R18 R19 R24 = R0603 10K 1% 100mW JLC: Res Thick Film 0603 10K Ohm 1% 0.1W(1/10W) ±100ppm/C Pad SMD; Manufacturer: Royal Ohm; Manufacturer Part Number: 0603WAF1002T5E; Resistance: 10kΩ; Temperature Coefficient: 100ppm/°C; Power Dissipation: 100mW; Working Voltage: 75V; Supplier 1: Mouser; Supplier Part Number 1: 303-0603WAF1002T5E; Stock 1: 225000; Pricing 1: 10000=0.001 (USD); RoHS: Compliant; Mount: Surface Mount; Min Operating Temperature: -55°C; Max Operating Temperature: 155°C; Tolerance: 1%; Length: 1.6mm; Height: 450µm; Width: 800µm; REACH SVHC: Yes; ComponentLink1URL: https://datasheet.octopart.com:443/0603WAF1002T5E-Royal-Electronics-datasheet-181080982.pdf?src-supplier=IHS; ComponentLink1Description: https://datasheet.octopart.com:443/0603WAF1002T5E-Royal-Electronics-datasheet-181080982.pdf?src-supplier=IHS; ComponentLink2URL: https://datasheet.octopart.com:443/0603WAF1002T5E-Royal-Ohm-datasheet-165785611.pdf?src-supplier=TME; ComponentLink2Description: https://datasheet.octopart.com:443/0603WAF1002T5E-Royal-Ohm-datasheet-165785611.pdf?src-supplier=TME; ComponentLink3URL: https://datasheet.octopart.com:443/0603WAF1002T5E-Royal-Ohm-datasheet-157855877.pdf?src-supplier=TME; ComponentLink3Description: https://datasheet.octopart.com:443/0603WAF1002T5E-Royal-Ohm-datasheet-157855877.pdf?src-supplier=TME; ComponentLink4URL: https://datasheet.octopart.com:443/0603WAF1002T5E-Royal-Ohm-datasheet-62069544.pdf?src-supplier=TME; ComponentLink4Description: https://datasheet.octopart.com:443/0603WAF1002T5E-Royal-Ohm-datasheet-62069544.pdf?src-supplier=TME; ComponentLink5URL: https://jlcpcb.com/partdetail/26547-0603WAF1002T5E/C25804; ComponentLink5Description: JLCPCB; Category: Chip SMD Resistors; China RoHS: Non-Compliant; Country of Origin: Thailand; Export Control Classification Number (ECCN) Code: EAR99; Harmonized Tariff Schedule (HTS) Code: 8533.21.00.30; Introduction Date: 2006-01-09; Lifecycle Status: Production; Number of Terminals: 2; Supplier: LCSC; Supplier Part Number: C25804
R9 = RC0603FR-0791KL: SMD Chip Resistor, 91 kOhm, ± 1%, 100 mW, 0603 [1608 Metric], Thick Film, General Purpose; Manufacturer: Yageo; Resistance: 91kR; Temperature Coefficient: 100ppm/°C; Voltage Rating (DC): 50V; Voltage Rating: 75V; Power Rating: 100mW; Supplier 1: Future Electronics; Manufacturer Part Number: RC0603FR-0791KL; RoHS: Yes; Category: Chip SMD Resistors; Stock 1: 250000; Pricing 1: 5000=0.0013, 50000=0.0013, 150000=0.0012, 375000=0.0012, 1000000=0.0011 (USD); Mount: Surface Mount; Case/Package: 0603; Case Code (Imperial): 0603; Case Code (Metric): 1608; Weight: 7.1E-05oz; Size Code: 0603; Min Operating Temperature: -55°C; Max Operating Temperature: 155°C; Packaging: Tape and Reel; Tolerance: 1%; Termination: SMD/SMT; Features: Moisture Resistant; Series: RC; Max Power Dissipation: 100mW; Number of Terminations: 2; Technology: THICK FILM; Construction: Rectangular; Length: 1.6mm; Width: 0.8mm; Height: 0.45mm; Depth: 0.8mm; Lead Free: Lead Free; Military Standard: Not; RoHS Compliant: Yes; ComponentLink1URL: https://datasheet.ciiva.com/11819/0900766b80c66297-11819716.pdf?src-supplier=Rs; ComponentLink1Description: https://datasheet.ciiva.com/11819/0900766b80c66297-11819716.pdf?src-supplier=Rs; ComponentLink2URL: https://datasheet.ciiva.com/15189/getdatasheetpartid-326529-15189837.pdf?src-supplier=Verical; ComponentLink2Description: https://datasheet.ciiva.com/15189/getdatasheetpartid-326529-15189837.pdf?src-supplier=Verical; Supplier Part Number 1: 1365832; Supplier: LCSC; Supplier Part Number: C137671; Value: 91k; ComponentLink3Description: LCSC; ComponentLink3URL: https://www.lcsc.com/product-detail/Chip-Resistor-Surface-Mount_YAGEO-RC0603FR-0791KL_C137671.html
R10-R17 = RC0603FR-0775RL: SMD Chip Resistor, 75 Ohm, ± 1%, 100 mW, 0603 [1608 Metric], Thick Film, General Purpose; Manufacturer: Yageo; Resistance: 75R; Temperature Coefficient: 100ppm/°C; Power Rating: 100mW; Voltage Rating: 50V; Value: 75R; Supplier 1: Future Electronics; Manufacturer Part Number: RC0603FR-0775RL; RoHS: Yes; Category: Chip SMD Resistors; Stock 1: 775000; Pricing 1: 5000=0.0014, 50000=0.0013, 200000=0.0012, 625000=0.0012, 2000000=0.0011 (USD); Case/Package: 0603; Case Code (Metric): 1608; Case Code (Imperial): 0603; Size Code: 0603; Min Operating Temperature: -55°C; Max Operating Temperature: 155°C; Tolerance: 1%; Resistor Type: Thick Film; Package Quantity: 1; Packaging: Tape and Reel; Number of Terminations: 2; Termination: SMD/SMT; Max Power Dissipation: 100mW; Features: Moisture Resistant; Series: RC; Resistance Tolerance: 1%; Construction: Rectangular; Technology: THICK FILM; Voltage Rating (DC): 50V; Length: 0.063inch; Width: 0.031inch; Height: 0.022inch; Depth: 0.8mm; Reach SVHC Compliant: No; Military Standard: Not; RoHS Compliant: Yes; Lead Free: 5697LeadFree; ComponentLink1URL: https://datasheet.ciiva.com/11819/0900766b80f96399-11819407.pdf?src-supplier=Rs; ComponentLink1Description: https://datasheet.ciiva.com/11819/0900766b80f96399-11819407.pdf?src-supplier=Rs; ComponentLink2URL: https://datasheet.ciiva.com/46395/443971-46395018.pdf?src-supplier=Element14; ComponentLink2Description: https://datasheet.ciiva.com/46395/443971-46395018.pdf?src-supplier=Element14; ComponentLink3URL: https://datasheet.ciiva.com/2453/pyu-r-int-thick-7-2453962.pdf?src-supplier=Digi-Key; ComponentLink3Description: https://datasheet.ciiva.com/2453/pyu-r-int-thick-7-2453962.pdf?src-supplier=Digi-Key; ComponentLink4URL: https://datasheet.ciiva.com/2453/pyu-r-int-thick-7-2453963.pdf?src-supplier=Digi-Key; ComponentLink4Description: https://datasheet.ciiva.com/2453/pyu-r-int-thick-7-2453963.pdf?src-supplier=Digi-Key; ComponentLink5URL: https://datasheet.ciiva.com/2453/pyu-r-int-thick-7-2453961.pdf?src-supplier=Digi-Key; ComponentLink5Description: https://datasheet.ciiva.com/2453/pyu-r-int-thick-7-2453961.pdf?src-supplier=Digi-Key; Supplier Part Number 1: 4693131; Supplier: LCSC; Supplier Part Number: C112309; ComponentLink6Description: LCSC; ComponentLink6URL: https://www.lcsc.com/product-detail/Chip-Resistor-Surface-Mount_YAGEO-RC0603FR-0775RL_C112309.html
R20 = RC0603FR-078K2L: Res Thick Film 0603 8.2K Ohm 1% 0.1W(1/10W) ±100ppm/C Pad SMD T/R; Manufacturer: Yageo; Resistance: 8.2kR; Voltage Rating (DC): 50V; Temperature Coefficient: 100ppm/°C; Power Rating: 100mW; Value: 10kR; Supplier 1: Future Electronics; Manufacturer Part Number: RC0603FR-078K2L; RoHS: Yes; Category: Chip SMD Resistors; Stock 1: 690000; Pricing 1: 5000=0.0015, 50000=0.0014, 150000=0.0014, 375000=0.0013, 1000000=0.0012 (USD); Case/Package: 0603; Number of Pins: 2; Case Code (Metric): 1608; Case Code (Imperial): 0603; Size Code: 0603; Min Operating Temperature: -55°C; Max Operating Temperature: 155°C; Tolerance: 1%; Packaging: Tape and Reel; Resistor Type: Thick Film; Voltage Rating: 50V; Package Quantity: 1; Number of Terminations: 2; Termination: SMD/SMT; Max Power Dissipation: 100mW; Features: Moisture Resistant; Series: RC; Resistance Tolerance: 1%; Technology: THICK FILM; Voltage Rating (AC): 50V; Length: 0.063inch; Width: 0.031inch; Height: 0.022inch; Depth: 0.8mm; Lead Pitch: 0.3mm; Reach SVHC Compliant: No; Lead Free: 5697LeadFree; RoHS Compliant: Yes; ComponentLink1URL: https://datasheet.ciiva.com/11808/0900766b80f96399-11808128.pdf?src-supplier=Rs; ComponentLink1Description: https://datasheet.ciiva.com/11808/0900766b80f96399-11808128.pdf?src-supplier=Rs; ComponentLink2URL: https://datasheet.ciiva.com/7746/443971-7746409.pdf?src-supplier=Element14; ComponentLink2Description: https://datasheet.ciiva.com/7746/443971-7746409.pdf?src-supplier=Element14; ComponentLink3URL: https://datasheet.ciiva.com/7746/443971-7746408.pdf?src-supplier=Element14; ComponentLink3Description: https://datasheet.ciiva.com/7746/443971-7746408.pdf?src-supplier=Element14; ComponentLink4URL: https://datasheet.ciiva.com/7660/38590-7660795.pdf?src-supplier=Element14; ComponentLink4Description: https://datasheet.ciiva.com/7660/38590-7660795.pdf?src-supplier=Element14; ComponentLink5URL: https://datasheet.ciiva.com/46412/443971-46412857.pdf?src-supplier=Element14; ComponentLink5Description: https://datasheet.ciiva.com/46412/443971-46412857.pdf?src-supplier=Element14; ComponentLink6URL: https://datasheet.ciiva.com/2454/pyu-r-int-thick-7-2454253.pdf?src-supplier=Digikey; ComponentLink6Description: https://datasheet.ciiva.com/2454/pyu-r-int-thick-7-2454253.pdf?src-supplier=Digikey; ComponentLink7URL: https://datasheet.ciiva.com/2454/pyu-r-int-thick-7-2454254.pdf?src-supplier=Digikey; ComponentLink7Description: https://datasheet.ciiva.com/2454/pyu-r-int-thick-7-2454254.pdf?src-supplier=Digikey; ComponentLink8URL: https://datasheet.ciiva.com/2454/pyu-r-int-thick-7-2454252.pdf?src-supplier=Digikey; ComponentLink8Description: https://datasheet.ciiva.com/2454/pyu-r-int-thick-7-2454252.pdf?src-supplier=Digikey; Supplier Part Number 1: 9121856; Supplier: LCSC; Supplier Part Number: C114637; ComponentLink9Description: LCSC; ComponentLink9URL: https://www.lcsc.com/product-detail/Chip-Resistor-Surface-Mount_YAGEO-RC0603FR-078K2L_C114637.html
R21 R22 = R1812 0R 1% 750mW: -55℃~+155℃ 0Ω 1W 200V Thick Film Resistor ±5% 1812 Chip Resistor - Surface Mount ROHS; Manufacturer: FOJAN; Manufacturer Part Number: FRC1812F0000TS; ComponentLink1Description: JLCPCB; ComponentLink1URL: https://jlcpcb.com/partdetail/FOJAN-FRC1812F0000TS/C2999613; Supplier: LCSC; Supplier Part Number: C2999613
R26 = R0603 330R 1% 100mW: Fixed Resistor, Metal Glaze/thick Film, 0.1W, 330ohm, 75V, 1% +/-Tol, 100ppm/Cel, Surface Mount, 0603; Manufacturer: Royal Ohm; Manufacturer Part Number: 0603WAF3300T5E; Power Dissipation: 100mW; Resistance: 330Ω; Temperature Coefficient: 100ppm/°C; Supplier 1: Mouser; RoHS: Compliant; Category: Chip SMD Resistors; Pricing 1: 10000=0.001 (USD); China RoHS: Non-Compliant; Country of Origin: Thailand; Export Control Classification Number (ECCN) Code: EAR99; Harmonized Tariff Schedule (HTS) Code: 8533.21.00.30; Introduction Date: 2016-08-18; Lifecycle Status: Production; Max Operating Temperature: 155°C; Min Operating Temperature: -55°C; Mount: Surface Mount; Number of Terminals: 2; REACH SVHC: Yes; Tolerance: 1%; Working Voltage: 75V; ComponentLink1URL: https://datasheet.octopart.com:443/0603WAF3300T5E-Royal-Ohm-datasheet-157855877.pdf?src-supplier=IHS; ComponentLink1Description: https://datasheet.octopart.com:443/0603WAF3300T5E-Royal-Ohm-datasheet-157855877.pdf?src-supplier=IHS; ComponentLink2URL: https://datasheet.octopart.com:443/0603WAF3300T5E-Royal-Ohm-datasheet-165785611.pdf?src-supplier=TME; ComponentLink2Description: https://datasheet.octopart.com:443/0603WAF3300T5E-Royal-Ohm-datasheet-165785611.pdf?src-supplier=TME; ComponentLink3URL: https://datasheet.octopart.com:443/0603WAF3300T5E-Royal-Ohm-datasheet-62069544.pdf?src-supplier=TME; ComponentLink3Description: https://datasheet.octopart.com:443/0603WAF3300T5E-Royal-Ohm-datasheet-62069544.pdf?src-supplier=TME; Supplier Part Number 1: 303-0603WAF3300T5E; ComponentLink4Description: JLCPCB; ComponentLink4URL: https://jlcpcb.com/partdetail/23865-0603WAF3300T5E/C23138; Supplier: LCSC; Supplier Part Number: C23138
T1 = H2415G: LAN Transformer 1:1 Surface Mount IEEE 802.3bt; Manufacturer: E-NETTR; Inductance: .35uH; Rate: 100/1000 Base-T; Manufacturer Part Number: H2415G; ComponentLink1URL: https://www.lcsc.com/product-detail/C4154999.html?s_z=n_H2415G; ComponentLink1Description: LCSC; ComponentLink2URL: https://jlcpcb.com/partdetail/ENETTR-H2415G/C4154999; ComponentLink2Description: JLCPCB; Supplier: LCSC; Supplier Part Number: H2415G
TP1-TP4 TP6-TP8 TP11 = Test_Point
U1 = AG5800: IEEE802.3bt 4-Pair PD Module - works with AG6800; Manufacturer: Silvertel; Supplier 1: Digi-Key; Manufacturer Part Number: AG5800; RoHS: No; Stock 1: 862; Pricing 1: 1=25.36, 10=24.65, 24=23.92, 48=23.2, 120=22.47, 264=22.00008 (USD); Supplier Part Number 1: 5061-AG5800-ND
U2 U5 = LM74700QDBVTQ1: Low IQ Reverse Battery Protection Ideal Diode Controller 3.2V to 65V 6-Pin SOT-23 T/R; Manufacturer: Texas Instruments; Turn-On Delay Time: 1.4us; Turn-Off Delay Time: 450ns; Max Output Current: 5A; Supplier 1: Mouser; Manufacturer Part Number: LM74700QDBVTQ1; RoHS: Yes; Category: Power Management ICs; Stock 1: 3771; Pricing 1: 1=2.39, 10=2.15, 25=2.03, 50=2.03, 100=1.73, 250=1.62, 500=1.41, 1000=1.17, 2500=1.1, 5000=1.07, 10000=1.07 (USD); Mount: Surface Mount; Case/Package: SOT-23-6; Min Operating Temperature: -40°C; Max Operating Temperature: 125°C; Series: Automotive, AEC-Q100; Packaging: Cut Tape; RoHS Compliant: Yes; ComponentLink1URL: http://www.ti.com/general/docs/suppproductinfo.tsp?distId=10&amp;gotoUrl=http%3A%2F%2Fwww.ti.com%2Flit%2Fgpn%2Flm74700-q1&src-supplier=Digi-Key; ComponentLink1Description: http://www.ti.com/general/docs/suppproductinfo.tsp?distId=10&amp;gotoUrl=http%3A%2F%2Fwww.ti.com%2Flit%2Fgpn%2Flm74700-q1&src-supplier=Digi-Key; Supplier Part Number 1: 595-LM74700QDBVTQ1; Supplier: LCSC; Supplier Part Number: C2653623; ComponentLink2Description: LCSC; ComponentLink2URL: https://www.lcsc.com/product-detail/Power-Distribution-Switches_Texas-Instruments-LM74700QDBVTQ1_C2653623.html
U3 U4 U6-U9 = OR-3H7B-TP-G: 80V 3750V 50mA 0.4V@2.4mA,8mA 1 6V 1.2V DC SOP-4-1.27mm Optocouplers - Phototransistor Output ROHS; Manufacturer: Orient; Manufacturer Part Number: OR-3H7B-TP-G; Supplier: LCSC; Supplier Part Number: C282477; Value: 80V 3750V 50mA; ComponentLink1Description: LCSC; ComponentLink1URL: https://www.lcsc.com/product-detail/Optocouplers-Phototransistor-Output_Orient-OR-3H7B-TP-G_C282477.html